# Altium schematic sheet Power_Supply_no_IC.SchDoc
size A; SheetNumber: 3; SheetTotal: 3
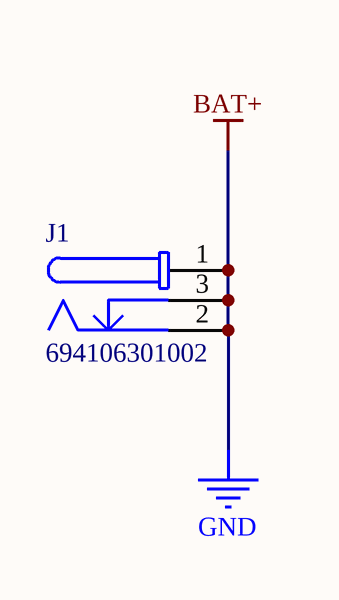
[diagram p0: Power_Supply_no_IC.SchDoc]

## Parts
J1  694106301002  [694106301002]

## Nets
BAT+: J1.1 J1.2 J1.3  [also labelled GND]

## Library data of the parts
J1 = CMP-1502-00188-2: NexarPartId: 52676100; Manufacturer: Wurth Electronics; Voltage Rating (DC): 20V; Gender: Male; Voltage Rating: 24V; Connector Type: Power; Insulation Resistance: 100MΩ; Current Rating: 5A; Shielding: Unshielded; Number of Contacts: 3; Color: Black; Housing Material: Polyamide; Contact Gender: Female; REACH SVHC: Unknown; Termination: Through Hole; Height: 11mm; RoHS: Compliant; Mount: Through Hole; Flammability Rating: UL94 V-0; Packaging: Bulk; Min Operating Temperature: -40°C; Contact Plating: Tin; Max Operating Temperature: 85°C; Operating Supply Voltage: 24V; Contact Material: Gold, Tin; Supplier: Digikey; Supplier Part Number: 732-5930-ND; Manufacturer Part Number: 694106301002; Category: Power Connectors; Stock: 12798; Pricing: 1=1.02, 10=0.97, 50=0.86, 100=0.8, 500=0.69, 1000=0.59 (USD); Contact Finish - Mating: NOT SPECIFIED; Reach SVHC Compliant: Yes; RoHS Compliant: Yes; ComponentLink1URL: https://datasheet.ciiva.com:443/pdfs/VipMasterIC/IC/MIDC/MIDC-S-A0001192814/MIDC-S-A0001192814-1.pdf?src-supplier=IHS+Markit; ComponentLink1Description: https://datasheet.ciiva.com:443/pdfs/VipMasterIC/IC/MIDC/MIDC-S-A0001192814/MIDC-S-A0001192814-1.pdf?src-supplier=IHS+Markit; ComponentLink2URL: http://www.mouser.com/ds/2/445/6941xx301002-469315.pdf?src-supplier=Mouser; ComponentLink2Description: http://www.mouser.com/ds/2/445/6941xx301002-469315.pdf?src-supplier=Mouser; ComponentLink3URL: http://www.farnell.com/cad/2130967.pdf?src-supplier=Element14; ComponentLink3Description: http://www.farnell.com/cad/2130967.pdf?src-supplier=Element14; ComponentLink4URL: https://katalog.we-online.de/em/datasheet/6941xx301002.pdf?src-supplier=Digikey; ComponentLink4Description: https://katalog.we-online.de/em/datasheet/6941xx301002.pdf?src-supplier=Digikey